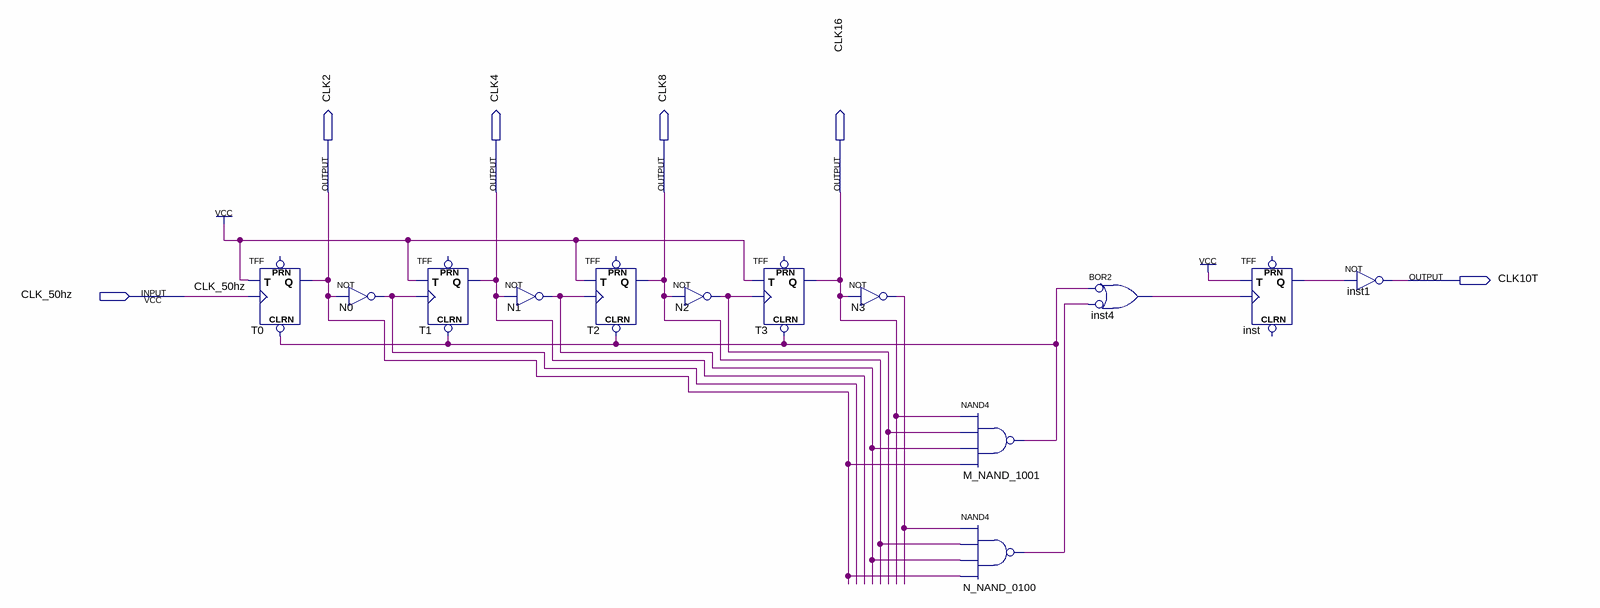
[diagram p0: schematic sheet]
// Quartus schematic Block_1_mn.bdf as structural Verilog: 13 symbols, 6 pins
module Block_1_mn (
  input  CLK_50hz,
  output CLK2,
  output CLK4,
  output CLK8,
  output CLK16,
  output CLK10T
);

  wire inst4_out, inst_q, M_NAND_1001_out, N0_out, N1_out, N2_out, N3_out, N_NAND_0100_out;

  TFF T0 (.CLRN(M_NAND_1001_out), .T(1'b1), .CLK(CLK_50hz), .Q(CLK2));  // open: PRN
  not N0 (N0_out, CLK2);
  TFF T1 (.CLRN(M_NAND_1001_out), .T(1'b1), .CLK(N0_out), .Q(CLK4));  // open: PRN
  not N1 (N1_out, CLK4);
  TFF T2 (.CLRN(M_NAND_1001_out), .T(1'b1), .CLK(N1_out), .Q(CLK8));  // open: PRN
  not N2 (N2_out, CLK8);
  TFF T3 (.CLRN(M_NAND_1001_out), .T(1'b1), .CLK(N2_out), .Q(CLK16));  // open: PRN
  not N3 (N3_out, CLK16);
  nand M_NAND_1001 (M_NAND_1001_out, CLK16, N2_out, N1_out, CLK2);
  nand N_NAND_0100 (N_NAND_0100_out, N3_out, CLK8, N1_out, CLK2);
  or inst4 (inst4_out, ~M_NAND_1001_out, ~N_NAND_0100_out);  // BOR2
  TFF inst (.T(1'b1), .CLK(inst4_out), .Q(inst_q));  // open: PRN, CLRN
  not inst1 (CLK10T, inst_q);
endmodule
